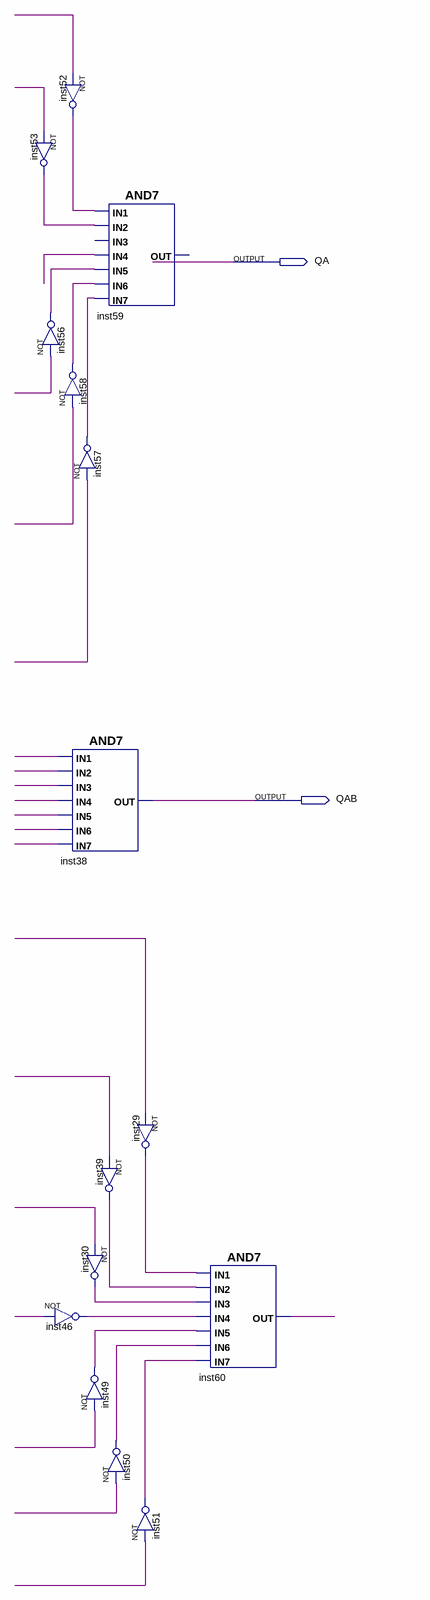
[diagram p0: schematic sheet]
// Quartus schematic TESTE.bdf as structural Verilog: 15 symbols, 2 pins
module TESTE (
  output QA,
  output QAB
);

  wire inst29_out, inst30_out, inst39_out, inst46_out, inst49_out, inst50_out, inst51_out, inst52_out,
       inst53_out, inst56_out, inst57_out, inst58_out, inst60_out, undriven, undriven_2, undriven_3,
       undriven_4, undriven_5, undriven_6, undriven_7, undriven_8, undriven_9, undriven_10, undriven_11,
       undriven_12, undriven_13, undriven_14, undriven_15, undriven_16, undriven_17, undriven_18,
       undriven_19, undriven_20;

  not inst53 (inst53_out, undriven_8);
  not inst52 (inst52_out, undriven_7);
  not inst56 (inst56_out, undriven_10);
  not inst58 (inst58_out, undriven_12);
  not inst57 (inst57_out, undriven_11);
  and inst38 (QAB, undriven_13, undriven_14, undriven_15, undriven_16, undriven_17, undriven_18, undriven_19);
  not inst30 (inst30_out, undriven_3);
  not inst46 (inst46_out, undriven_20);
  not inst49 (inst49_out, undriven_4);
  // AND7 inst59 has open pins: IN1=inst52_out, IN2=inst53_out, IN3=open, IN4=undriven_9, IN5=inst56_out, IN6=inst58_out, IN7=inst57_out, OUT=open
  not inst29 (inst29_out, undriven);
  not inst39 (inst39_out, undriven_2);
  not inst50 (inst50_out, undriven_5);
  not inst51 (inst51_out, undriven_6);
  and inst60 (inst60_out, inst29_out, inst39_out, inst30_out, inst46_out, inst49_out, inst50_out, inst51_out);
endmodule
